# EAGLE schematic rosalina new (EAGLE 7.5.0)
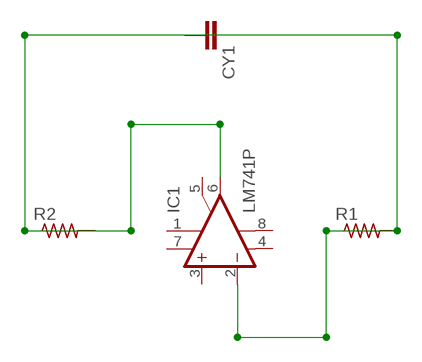
[diagram p0: schematic, sheet 1]

## Parts
CY1  CYYC7B5  [YC7B5]
IC1  LM741P  [DIL08]
R1  R-US_0204/7  [0204/7]
R2  R-US_0204/7  [0204/7]

## Nets
N$1: IC1.2(-IN) IC1.6(OUT) R1.1 R1.2 R2.1
Unconnected: CY1.1 CY1.2 IC1.1(ON1) IC1.3(+IN) IC1.5(ON2) IC1.8(OPT) R2.2

## Power pins joined to a net without a drawn wire
V+: IC1.7(V+)
V-: IC1.4(V-)

## Library data of the parts
CY1 = rcl:CY: Y CAPACITOR for power line
IC1 = linear:*741: OP AMP
R1 R2 = rcl:R-US_: RESISTOR, American symbol